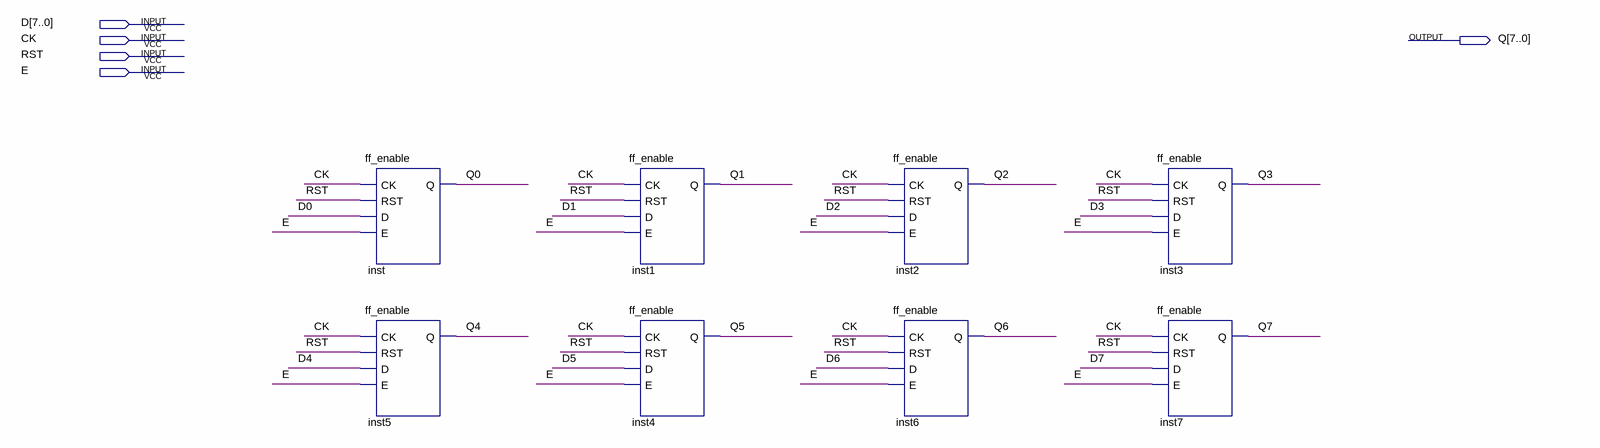
[diagram p0: schematic sheet]
// Quartus schematic registrador_8bits.bdf as structural Verilog: 8 symbols, 5 pins
module registrador_8bits (
  input  [7:0] D,
  input  CK,
  input  RST,
  input  E,
  output [7:0] Q
);

  ff_enable inst (.CK(CK), .RST(RST), .D(D[0]), .E(E), .Q(Q[0]));
  ff_enable inst5 (.CK(CK), .RST(RST), .D(D[4]), .E(E), .Q(Q[4]));
  ff_enable inst1 (.CK(CK), .RST(RST), .D(D[1]), .E(E), .Q(Q[1]));
  ff_enable inst4 (.CK(CK), .RST(RST), .D(D[5]), .E(E), .Q(Q[5]));
  ff_enable inst2 (.CK(CK), .RST(RST), .D(D[2]), .E(E), .Q(Q[2]));
  ff_enable inst6 (.CK(CK), .RST(RST), .D(D[6]), .E(E), .Q(Q[6]));
  ff_enable inst3 (.CK(CK), .RST(RST), .D(D[3]), .E(E), .Q(Q[3]));
  ff_enable inst7 (.CK(CK), .RST(RST), .D(D[7]), .E(E), .Q(Q[7]));
endmodule
